# Altium project stepperdriver.PrjPcb
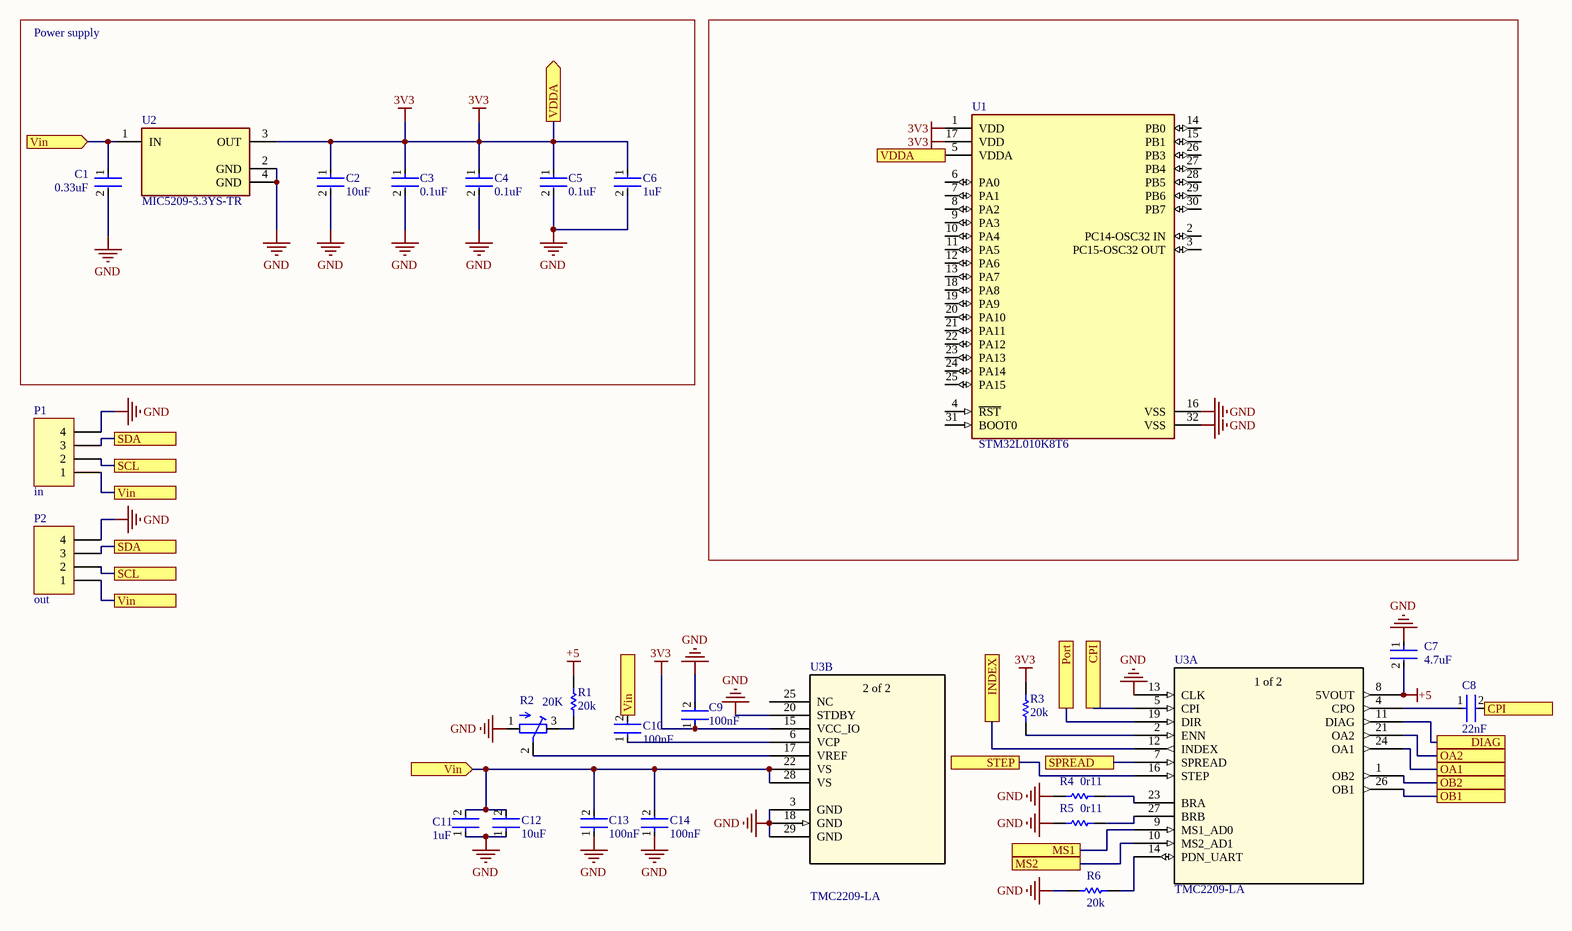
[diagram p0: stepperDriver.SchDoc]
Revision: R1; Title: Stepper Driver
1 sheet, 25 parts. Net scope: flat (ports and power ports of the same name join across sheets).
Board file: stepperdriver.PcbDoc

## Sheet stepperDriver.SchDoc: Stepper Driver
size A3; Author: Thomas IJsseldijk; SheetNumber: 1; SheetTotal: 1

### Parts
C1  0.33uF  [FP-CL31-IPC_C]
C2  10uF  [FP-CL31-IPC_A]
C3  0.1uF  [FP-CGA5L-MFG]
C4  0.1uF  [FP-CGA5L-MFG]
C5  0.1uF  [FP-CGA5L-MFG]
C6  1uF  [FP-CL31-IPC_A]
C7  4.7uF  [FP-CL21-IPC_C]
C8  22nF  [FP-CL31-IPC_A]
C9  100nF  [FP-CL31-IPC_C]
C10  100nF  [FP-CL31-IPC_C]
C11  1uF  [FP-CL31-IPC_A]
C12  10uF  [FP-CL31-IPC_C]
C13  100nF  [FP-CL31-IPC_C]
C14  100nF  [FP-CL31-IPC_C]
P1  in  [HDR1X4H]
P2  out  [HDR1X4H]
R1  20k  [RESC3216X70X50LL05T20]
R2  20K  [RTRIMTS53YJ]
R3  20k  [RESC3216X70X50LL05T20]
R4  0r11  [RESC3216X70X50LL05T20]
R5  0r11  [RESC3216X70X50LL05T20]
R6  20k  [RESC3216X70X50LL05T20]
U1  STM32L010K8T6  [FP-LQFP32-5V-MFG]
U2  MIC5209-3.3YS-TR  [FP-SOT223-3LD-PL-1-MFG]
U3  TMC2209-LA  [QFN28_5X5_TRI]  (parts A,B of 2)

### Blocks framed on the sheet
Power supply: C1-C6 U2

### Ports
CPI, DIAG, INDEX, MS1, MS2, OA1, OA2, OB1, OB2, Port, SCL, SDA, SPREAD, STEP, VDDA (in), VDDA (out), Vin, Vin (in)

### Nets
3V3: C2.1 C3.1 C4.1 C5.1 C6.1 C9.1 R3.1 U1.1(VDD) U1.5(VDDA) U1.17(VDD) U2.3(OUT) U3.15(VCC_IO) ; port VDDA
+5: C7.2 R1.2 U3.8(5VOUT)
GND: C1.2 C2.2 C3.2 C4.2 C5.2 C6.2 C7.1 C9.2 C11.1 C12.1 C13.1 C14.1 P1.4 P2.4 R2.1(A) R4.1 R5.1 R6.1 U1.16(VSS) U1.32(VSS) U2.2(GND) U2.4(GND) U3.3(GND) U3.13(CLK) U3.18(GND) U3.20(STDBY) U3.29(GND)
NetC1_1: C1.1 C10.2 C11.2 C12.2 C13.2 C14.2 P1.1 P2.1 U2.1(IN) U3.22(VS) U3.28(VS) ; port Vin
NetC8_1: C8.1 U3.4(CPO)
NetC8_2: C8.2 U3.5(CPI) ; port CPI
NetC10_1: C10.1 U3.6(VCP)
NetP1_2: P1.2 P2.2 ; port SCL
NetP1_3: P1.3 P2.3 ; port SDA
NetR1_1: R1.1 R2.3(E)
NetR2_2: R2.2(S) U3.17(VREF)
NetR3_2: R3.2 U3.2(ENN)
NetR4_2: R4.2 U3.23(BRA)
NetR5_2: R5.2 U3.27(BRB)
NetR6_2: R6.2 U3.14(PDN_UART)
NetU3_1: U3.1(OB2) ; port OB2
NetU3_7: U3.7(SPREAD) ; port SPREAD
NetU3_9: U3.9(MS1_AD0) ; port MS1
NetU3_10: U3.10(MS2_AD1) ; port MS2
NetU3_11: U3.11(DIAG) ; port DIAG
NetU3_12: U3.12(INDEX) ; port INDEX
NetU3_16: U3.16(STEP) ; port STEP
NetU3_19: U3.19(DIR) ; port Port
NetU3_21: U3.21(OA2) ; port OA2
NetU3_24: U3.24(OA1) ; port OA1
NetU3_26: U3.26(OB1) ; port OB1

Not connected (* = marked no-connect by the designer): U1 2(PC14-OSC32_IN) 3(PC15-OSC32_OUT) 4(~{RST}) 6(PA0) 7(PA1) 8(PA2) 9(PA3) 10(PA4) 11(PA5) 12(PA6) 13(PA7) 14(PB0) 15(PB1) 18(PA8) 19(PA9) 20(PA10) 21(PA11) 22(PA12) 23(PA13) 24(PA14) 25(PA15) 26(PB3) 27(PB4) 28(PB5) 29(PB6) 30(PB7) 31(BOOT0); U3 25(NC)

### Notes on the sheet
- (in symbol TMC2209-LA, part A) 1 of 2
- (in symbol TMC2209-LA, part B) 2 of 2

### Library data of the parts
C1 = CMP-13271-000138-1: Cap Ceramic 330pF 50V C0G ±5% SMD 1206 +125°C Embossed T/R; Temperature Coefficient: 300ppm/°C; Thickness: 0.039inch; Voltage: 50V; Material: Ceramic; Case Code (Imperial): 1206; Capacitance: 330pF; Tolerance: 5%; Mount: Surface Mount; Width: 0.063inch; Case Code (Metric): 3216; Depth: 1.6mm; Dielectric: C0G; Length: 3.2mm; Case/Package: 1206; Max Operating Temperature: 125°C; Min Operating Temperature: -55°C; Package Quantity: 1; Radiation Hardening: No; Voltage Rating: 50V; Height: 0.85mm; Packaging: Tape and Reel
C2 = CMP-13271-002819-1: Cap Ceramic 10uF 16V X5R ±10% SMD 1206 +85°C Embossed T/R; Length: 3.2mm; Voltage: 16V; Thickness: 0.071inch; Width: 0.063inch; Radiation Hardening: No; Tolerance: 10%; Min Operating Temperature: -55°C; Mount: Surface Mount; Voltage Rating: 16V; Capacitance: 10uF; Material: Ceramic; Case Code (Metric): 3216; Depth: 1.6mm; Packaging: Tape and Reel; Lead Free: Lead Free; Dielectric: X5R; Contact Plating: Tin; Case Code (Imperial): 1206; Height: 1.6mm; Voltage Rating (DC): 16V; Max Operating Temperature: 85°C; Case/Package: 1206
C3-C5 = CMP-08246-000029-1: CAP CER 0.1UF 50V C0G 1206; Manufacturer: TDK; Manufacturer Part Number: CGA5L2C0G1H104J160AA; Temperature Coefficient: 30ppm/°C; Material: Ceramic; Automotive Grade: Grade 1; Capacitance: 100nF; Tolerance: 5%; Value: 100nF; Device Class L1: Passive Components; Ipc Land Pattern Name: CAPC320160X160; Device Class L3: Ceramic Capacitors; Temperature Characteristic: C0G; Lead Free: Yes; Category: Cap; Octopart: https://octopart.com/cga5l2c0g1h104j160aa-tdk-26014808; Temperature Range High: +125°C; Digikey Description: CAP CER 0.1UF 50V C0G 1206; Automotive: Yes; Package: CGA5L; Voltage Rating: 50V; Height: 1.8mm; ComponentLink2Description: Datasheet; Device Class L2: Capacitors; RoHS: TRUE; Temperature: -55°C to +125°C; Temperature Range Low: -55°C; Mouser Description: Eia Case Size: 1206, Voltage: 50, Cap Value: 100000, Tol: +/-5%, Thickness: 1.60 ± 0.20; ComponentLink2URL: https://product.tdk.com/info/en/catalog/datasheets/mlcc_automotive_general_en.pdf
C6 C11 = CMP-13271-003959-1: Cap Ceramic 1uF 16V Y5V -20/+80% SMD 1206 +85°C Embossed T/R; Tolerance: 80%; Length: 3.2mm; Package Quantity: 4000; Lead Free: Lead Free; Height: 0.85mm; Packaging: Tape and Reel; Max Operating Temperature: 85°C; Case Code (Imperial): 1206; Case/Package: 1206; Dielectric: Y5V; Capacitance: 1uF; Min Operating Temperature: -30°C; Voltage Rating (DC): 16V; Width: 0.063inch; Mount: Surface Mount; Voltage Rating: 16V; Depth: 1.6mm; Thickness: 0.039inch; Radiation Hardening: No; Case Code (Metric): 3216
C7 = CMP-13271-004306-1: CL21 Series 0805 4.7uF 50V ±10% Tolerance X5R Multilayer Ceramic Chip Capacitor; Max Operating Temperature: 85°C; Case Code (Metric): 2012; Voltage Rating: 50V; Case Code (Imperial): 0805; Dielectric: X5R; Depth: 1.25mm; Mount: Surface Mount; Length: 2mm; Radiation Hardening: No; Width: 0.049inch; Package Quantity: 1; Packaging: Tape and Reel; Capacitance: 4.7uF; Min Operating Temperature: -55°C; Thickness: 0.055inch; Case/Package: 0805; RoHS Compliant: Yes; Series: CL; Tolerance: 10%
C8 = CMP-13271-002163-1: Cap Ceramic 22nF 50V X7R ±10% SMD 1206 +125°C Embossed T/R; Case Code (Imperial): 1206; Thickness: 0.039inch; Max Operating Temperature: 125°C; Voltage Rating: 50V; Min Operating Temperature: -55°C; Case Code (Metric): 3216; Depth: 1.6mm; Length: 3.2mm; Tolerance: 10%; Case/Package: 1206; Packaging: Tape and Reel; Dielectric: X7R; Height: 0.85mm; Width: 0.063inch; Radiation Hardening: No; Capacitance: 22nF; Package Quantity: 1; Voltage: 50V; Material: Ceramic; Mount: Surface Mount
C9 C10 C13 C14 = CMP-13271-001731-1: Cap Ceramic 100nF 50V X7R ±10% SMD 1206 +125°C Embossed T/R; Voltage: 50V; Thickness: 0.037inch; Lead Free: Lead Free; Length: 3.2mm; Min Operating Temperature: -55°C; Package Quantity: 15000; Packaging: Tape and Reel; Mount: Surface Mount; Depth: 1.6mm; Case/Package: 1206; Voltage Rating (DC): 50V; Tolerance: 10%; Height: 0.85mm; Capacitance: 100nF; Radiation Hardening: No; Dielectric: X7R; Voltage Rating: 50V; Max Operating Temperature: 125°C; Width: 0.063inch
C12 = CMP-13271-000016-1: CAP CER 10UF 50V X5R 1206; Manufacturer: Samsung; Manufacturer Part Number: CL31A106KBHNNNE; Tolerance: 10%; Material: Ceramic; Temperature Coefficient: 15%; RoHS: TRUE; Ipc Land Pattern Name: CAPC320160X160; Temperature Range Low: -55°C; Value: 10uF; Device Class L3: Ceramic Capacitors; Category: Cap; Temperature Characteristic: X5R; Lead Free: Yes; Device Class L2: Capacitors; Octopart: https://octopart.com/cl31a106kbhnnne-samsung-19832778; ComponentLink2Description: Datasheet; Digikey Description: CAP CER 10UF 50V X5R 1206; Voltage: 50V; ComponentLink2URL: http://www.samsungsem.com/kr/support/product-search/mlcc/__icsFiles/afieldfile/2018/06/21/CL31A106KBHNNNE.pdf; Capacitance: 10uF; Temperature Range High: +85°C; Device Class L1: Passive Components; Height: 1.8mm; Automotive: No; Voltage Rating: 50V; Package: CL31; Temperature: -55°C to +85°C
P1 P2 = Header 4H: Header, 4-Pin, Right Angle; LatestRevisionDate: 17-Jul-2002; LatestRevisionNote: Re-released for DXP Platform.; Publisher: Altium Limited
R1 R3 R6 = CMP-1014-00105-2: Manufacturer: Panasonic; Part Number: ERJ-8GEYJ203V
R2 = TS53YJ: MF: {'manufacturer': u'Vishay Sfernice'}; Price: None; Value: *; MP: TS53YJ; Package: None; Availability: Unavailable
R4 R5 = CMP-2003-00787-1: Manufacturer: Panasonic; Part Number: ERJ8CWFR011V
U1 = CMP-12105-000073-1: 16/32-BITS MICROS; Manufacturer: STMicroelectronics; Memory Type: FLASH,SRAM,EEPROM; Number Of Spi Channels: 1; Memory Size: 64KBytes; Max Junction Temp: +105°C; Core Architecture: Arm Cortex-M0+; Interface: I2C,SPI,UART,USART,IrDA,SMBus; Number Of Timers/Counters: 5; Number Of Adc Channels: 16; Max Supply Voltage: 3.6V; Data Bus Width: 32bits; Frequency: 32MHz; Min Supply Voltage: 1.8V; Number Of I/Os: 25; Number Of Uart Channels: 2; Ram Size: 8KBytes; Standoff Height: 0.05mm; Lead Free: Yes; Category: IC; Temperature: -40°C to +85°C; Octopart: https://octopart.com/stm32l010k8t6-stmicroelectronics-96493834; Device Class L3: Microcontrollers; Height: 1.6mm; Automotive: No; Mouser Description: Cortex M0+ 64K LQFP32 85°C; Number Of I2C Channels: 1; Package: LQFP32-5V; Temperature Range High: +85°C; Ambient Temperature Range High: +85°C; ComponentLink2Description: Datasheet; Ambient Temperature Range Low: -40°C; Digikey Description: 16/32-BITS MICROS; RoHS: TRUE; Device Class L2: Embedded Processors and Controllers; Number Of Cores: 1; Number Of A/D Converters: 1; Temperature Range Low: -40°C; ComponentLink2URL: https://www.st.com/resource/en/datasheet/stm32l010k8.pdf; Manufacturer Part Number: STM32L010K8T6; Device Class L1: Integrated Circuits (ICs)
U2 = CMP-06324-000084-1: IC REG LINEAR 3.3V 500MA SOT223; Dropout Voltage: 350mV; Output Type: Fixed; Min Input Voltage: 2.5V; Max Input Voltage: 16V; Number of Regulators: 1; Number of Pins: 3; REACH SVHC: No SVHC; Min Operating Temperature: -40°C; Packaging: Cut Tape; Output Current: 500mA; Max Operating Temperature: 125°C; Nominal Output Voltage: 3.3V; Output Voltage: 3.3V; Mount: Surface Mount; Case/Package: SOT-223; Lead Free: Lead Free
U3 = TMC2209-LA: No Description Available; Mfr_Name: Trinamic; Copyright: Copyright (C) 2022 Ultra Librarian. All rights reserved.; Manufacturer_Part_Number: TMC2209-LA; RefDes: RefDes; Type: DEV